# EasyEDA Pro project 电子挂牌.eprj, board PCB1
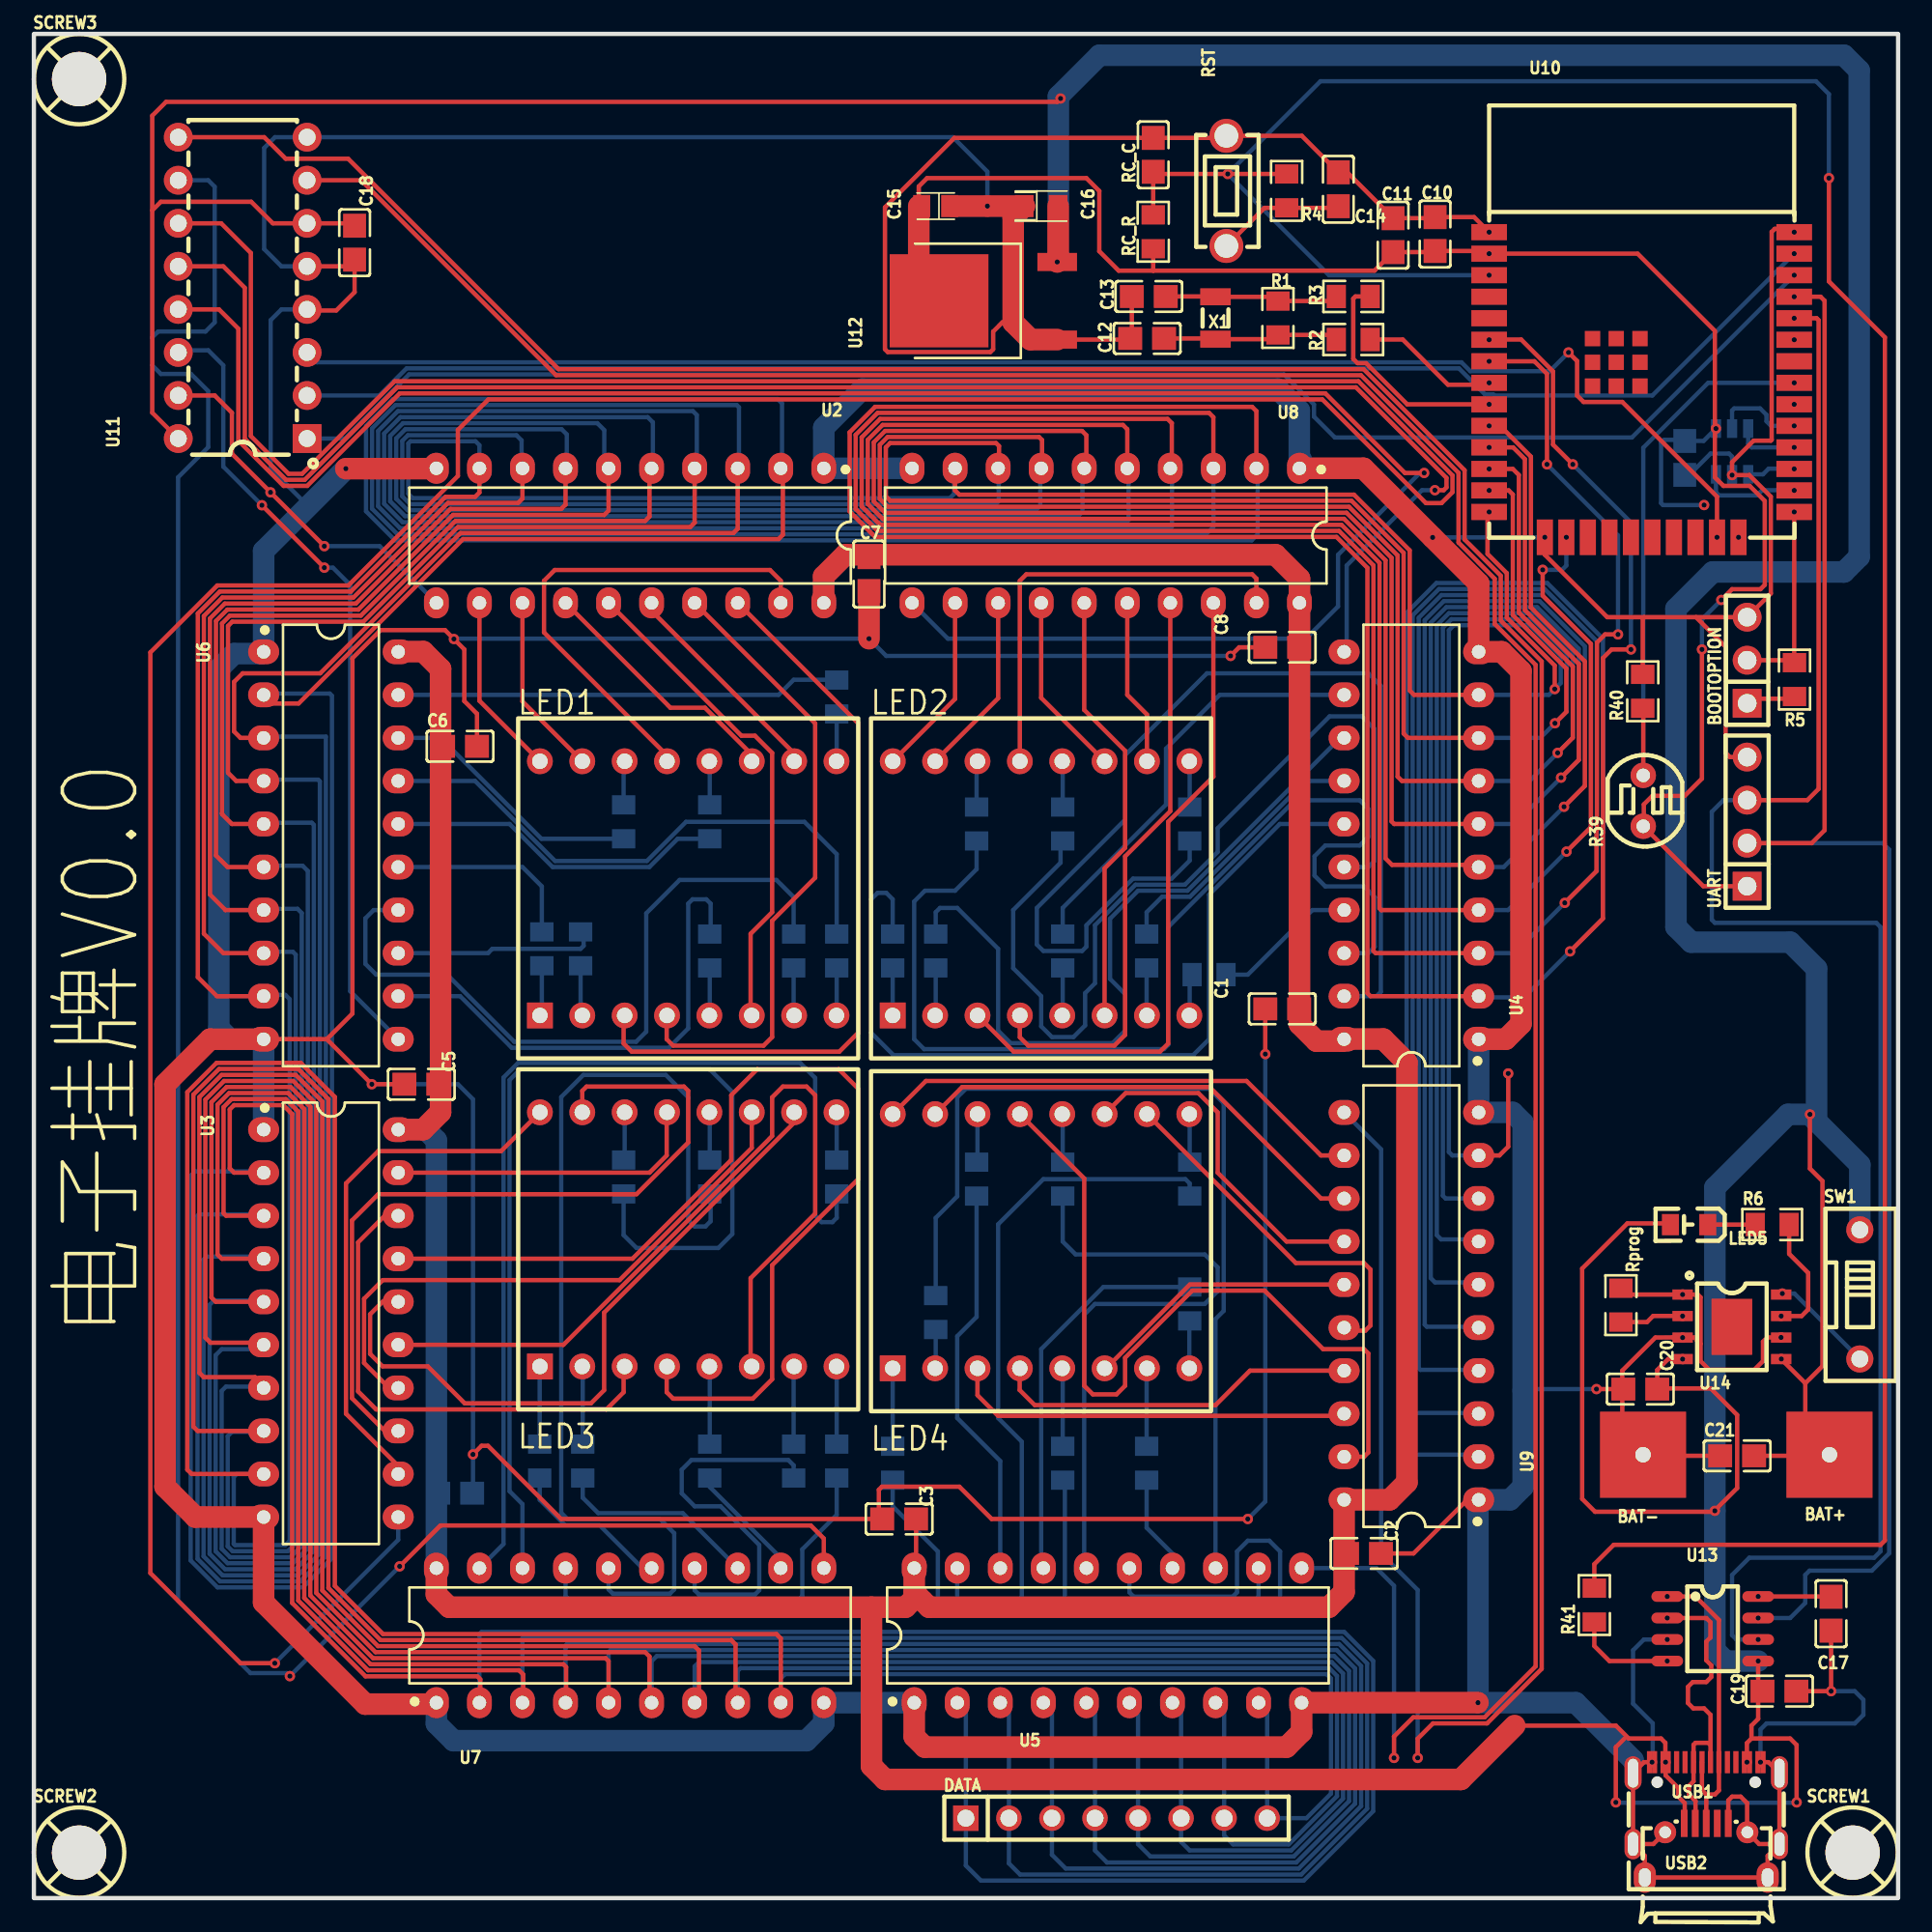
[diagram p1: board, top side]
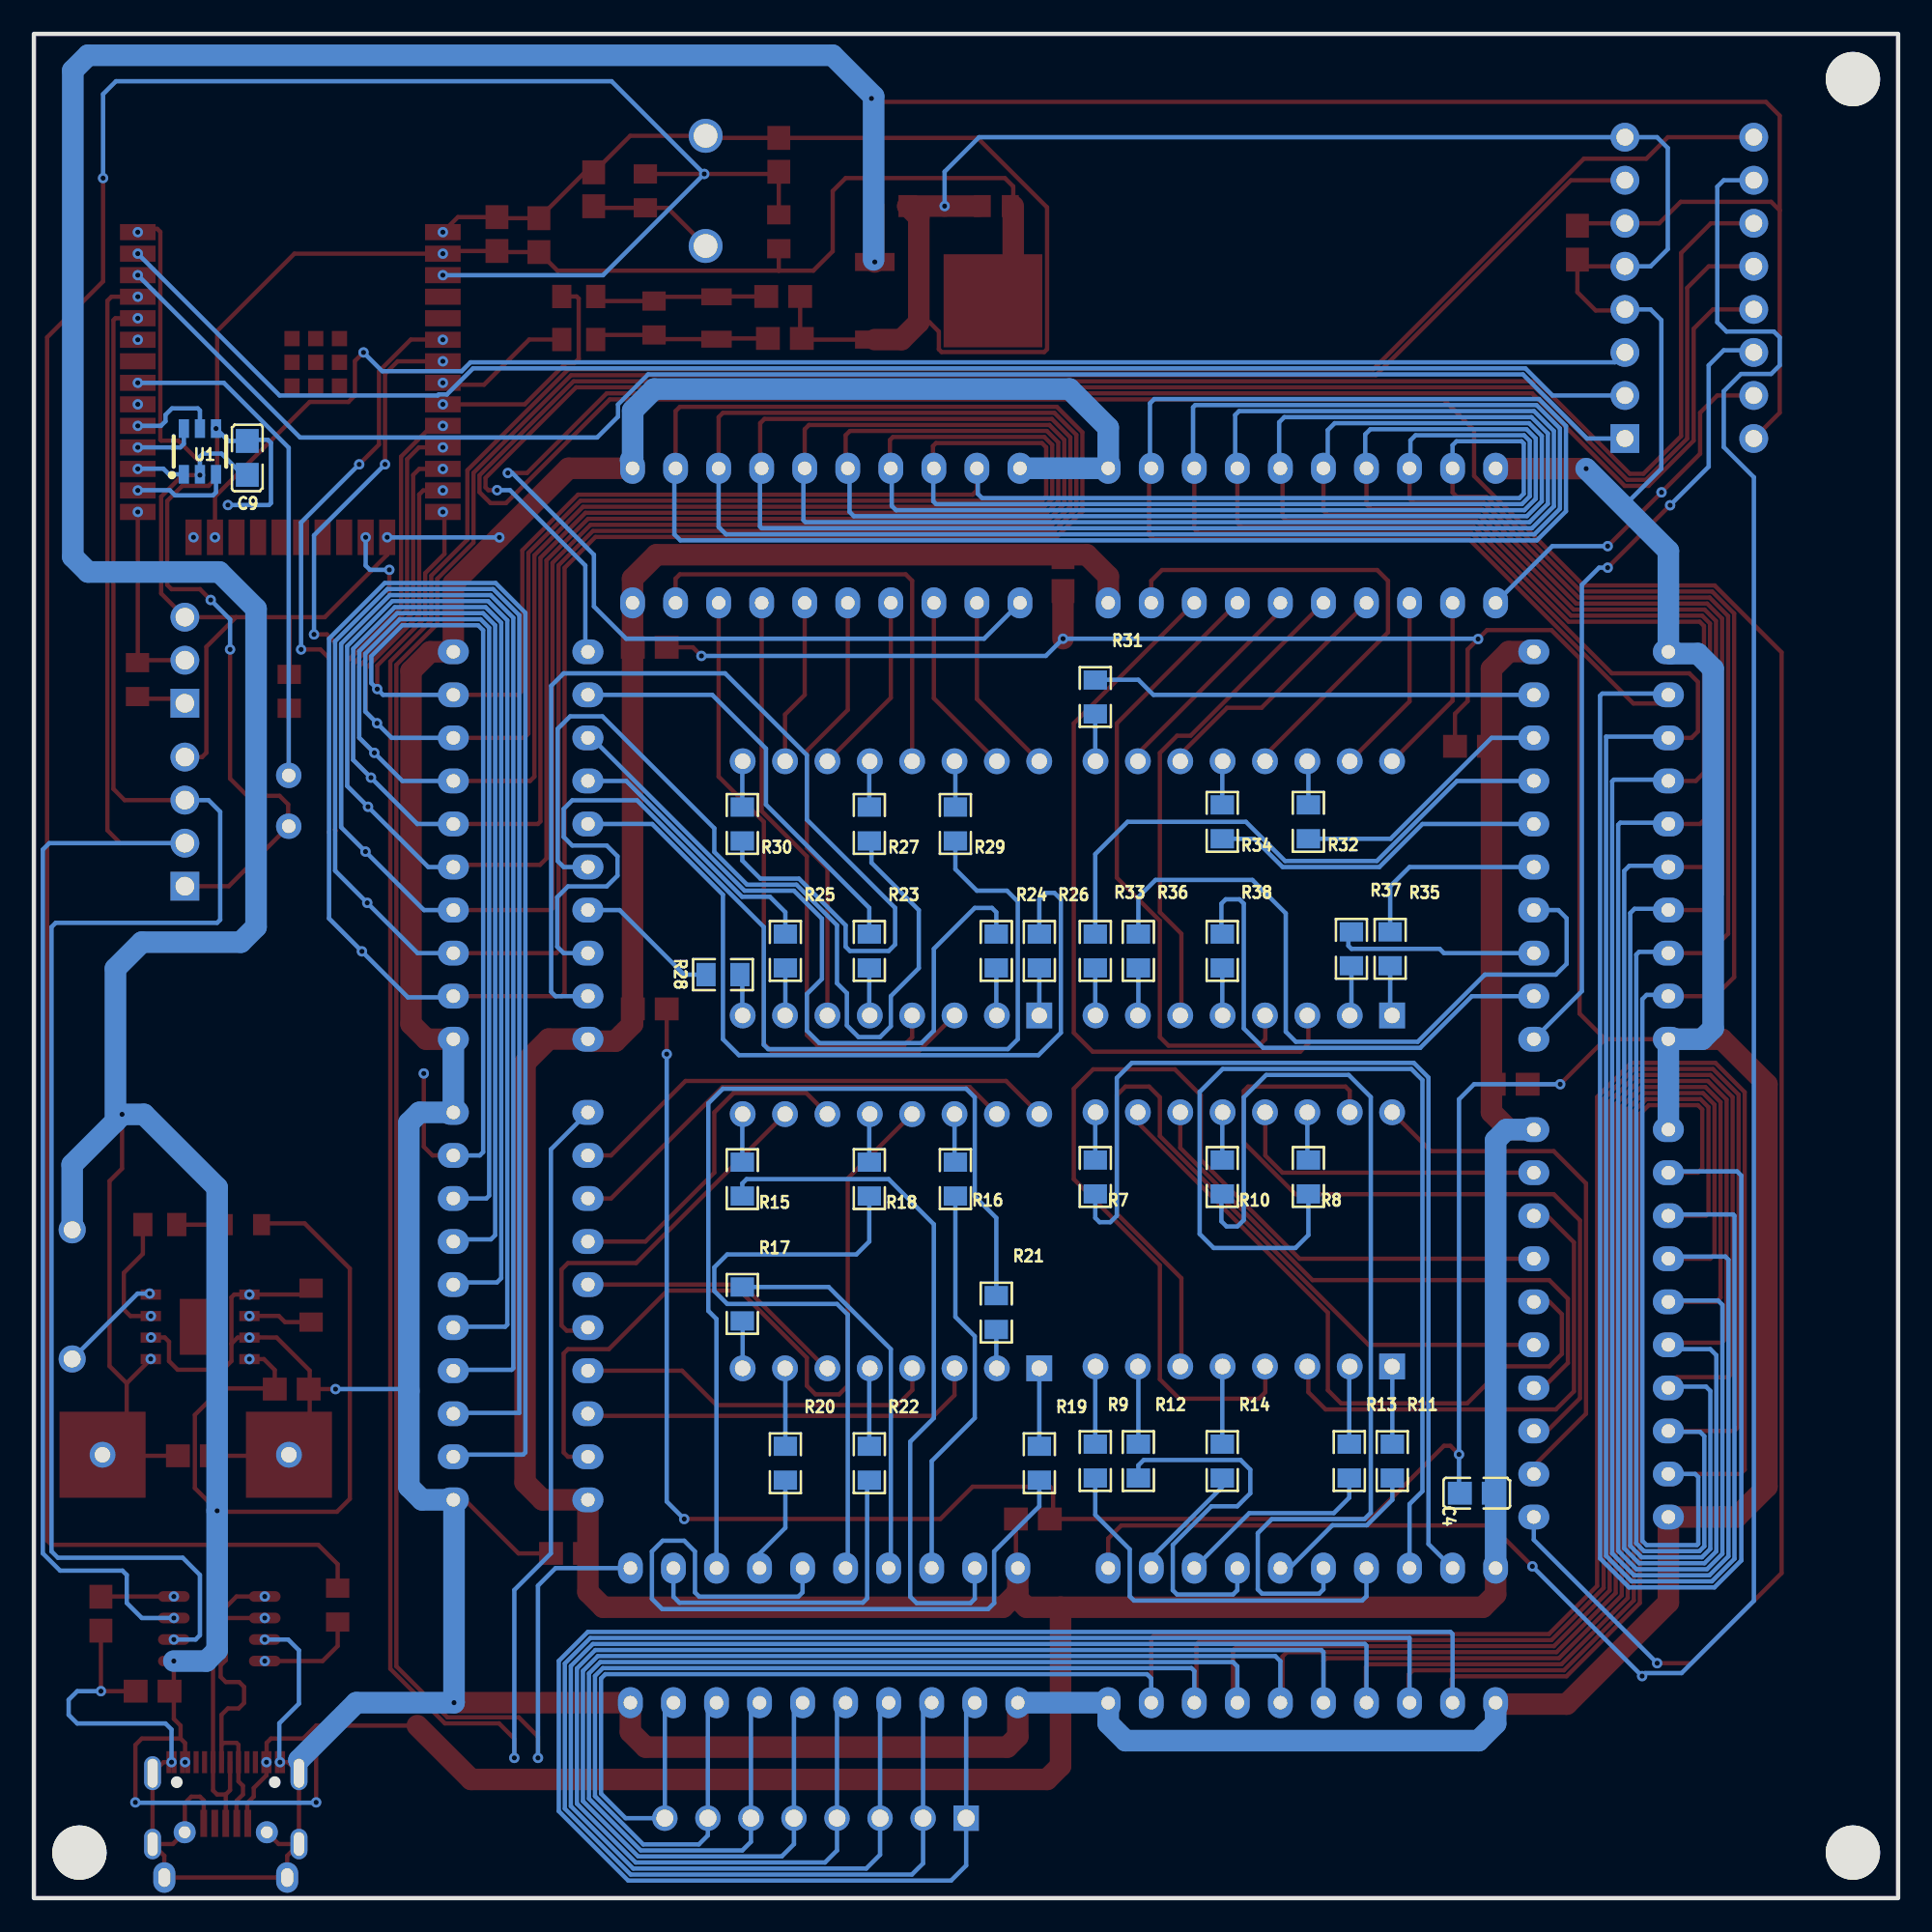
[diagram p2: board, bottom side, seen from below]

Outline 110 x 110 mm; copper layers: Top Layer, Bottom Layer. Coordinates in mm from the lower left corner of the outline.
Outline path: rectangle 0,110 110,0
Stack: Top Layer 0.035mm / Dielectric1 1.51mm FR4 er 4.5 / Bottom Layer 0.035mm

## Design rules (mm)
net UD+: DP1
net UD-: DP1
template: JLCPCB Capability(Two Layers Board)
spacing copperThickness1oz (default): track to track 0.102, other pairs 0.152 to 0.3
spacing copperThickness2oz: track to track 0.203, other pairs 0.152 to 0.3
track width copperThickness1oz (default): min 0.127, default 0.254, max 2.54
track width copperThickness2oz: min 0.203, default 0.254, max 2.54
differential pair differentialPair (default): width min 0.127, default 0.254, max 2.54; gap min 0.152, default 0.152
via viaSize (default): diameter min 0.5, default 0.61, max 10; hole min 0.3, default 0.305, max 6.3

## Placement (name value [footprint] x y rotation side)
BAT+  -  [Test-Point-0.5mm]  105.95 26.16 270 top
BAT-  -  [Test-Point-0.5mm]  94.95 26.16 270 top
BOOTOPTION  PZ254V-11-03P  [HDR-TH_3P-P2.54-V-M]  101.09 73.04 90 top
C1  0.1uf  [C0805]  73.66 52.47 180 top
C2  0.1uf  [C0805]  78.49 20.34 0 top
C3  0.1uf  [C0805]  51.05 22.37 180 top
C4  0.1uf  [C0805]  24.86 23.89 0 bottom
C5  0.1uf  [C0805]  22.86 48.02 180 top
C6  0.1uf  [C0805]  25.15 67.96 0 top
C7  0.1uf  [C0805]  49.28 78.12 270 top
C8  0.1uf  [C0805]  73.66 73.8 180 top
C9  0.1uf  [C0805]  97.41 84.98 270 bottom
C10  0.1uf  [C0805]  82.68 98.19 270 top
C11  22uf  [C0805]  80.2 98.13 270 top
C12  12pf  [C0805]  65.69 92.03 0 top
C13  12pf  [C0805]  65.79 94.51 0 top
C14  0.1uf  [C0805]  76.97 100.83 270 top
C15  10uF  [CAP-SMD_L2.1-W1.4-FD]  53.21 99.84 180 top
C16  22uF  [CAP-SMD_L2.0-W1.3-FD]  59.44 99.84 0 top
C17  0.1uf  [C0805]  106.05 16.78 270 top
C18  0.1uf  [C0805]  18.92 97.68 270 top
C19  0.1uf  [C0805]  103 12.21 0 top
C20  10uf  [C0805]  94.79 30.03 180 top
C21  10uf  [C0805]  100.5 26.1 0 top
DATA  PZ254V-11-08P  [HDR-TH_8P-P2.54-V-M]  63.88 4.72 0 top
LED1  SLD0888FR1C1BD-3.5D  [LED-MAT-TH_SLD0888FR1C1BD-3.5D]  38.61 59.58 0 top
LED2  SLD0888FR1C1BD-3.5D  [LED-MAT-TH_SLD0888FR1C1BD-3.5D]  59.43 59.58 0 top
LED3  SLD0888FR1C1BD-3.5D  [LED-MAT-TH_SLD0888FR1C1BD-3.5D]  38.61 38.87 0 top
LED4  SLD0888FR1C1BD-3.5D  [LED-MAT-TH_SLD0888FR1C1BD-3.5D]  59.43 38.76 0 top
LED5  -  [LED_0805]  97.62 39.74 180 top
NOREF  -  [Pad_e7802]  105.95 26.16 0 top
NOREF#2  -  [Pad_e7801]  94.95 26.16 0 top
R1  5M~10M  [R0805]  73.41 93.24 270 top
R2  0  [R0805]  77.85 91.97 0 top
R3  0  [R0805]  77.85 94.51 0 top
R4  0  [R0805]  73.92 100.74 90 top
R5  0  [R0805]  103.89 71.9 270 top
R6  10K  [R0805]  102.57 39.74 0 top
R7  10K  [R0805]  47.37 42.55 90 bottom
R8  10K  [R0805]  34.8 42.55 90 bottom
R9  10K  [R0805]  47.37 25.79 90 bottom
R10  10K  [R0805]  39.88 42.55 90 bottom
R11  10K  [R0805]  29.84 25.79 90 bottom
R12  10K  [R0805]  44.83 25.79 90 bottom
R13  10K  [R0805]  32.39 25.79 90 bottom
R14  10K  [R0805]  39.88 25.79 90 bottom
R15  10K  [R0805]  68.2 42.42 90 bottom
R16  10K  [R0805]  55.63 42.42 90 bottom
R17  10K  [R0805]  68.2 35.06 270 bottom
R18  10K  [R0805]  60.71 42.42 90 bottom
R19  10K  [R0805]  50.67 25.66 90 bottom
R20  10K  [R0805]  65.66 25.66 90 bottom
R21  10K  [R0805]  53.21 34.55 270 bottom
R22  10K  [R0805]  60.71 25.66 90 bottom
R23  10K  [R0805]  60.71 55.89 270 bottom
R24  10K  [R0805]  53.21 55.89 270 bottom
R25  10K  [R0805]  65.66 55.89 270 bottom
R26  10K  [R0805]  50.67 55.89 270 bottom
R27  10K  [R0805]  60.71 63.38 90 bottom
R28  10K  [R0805]  69.34 54.49 180 bottom
R29  10K  [R0805]  55.63 63.38 90 bottom
R30  10K  [R0805]  68.2 63.38 90 bottom
R31  10K  [R0805]  47.37 70.87 270 bottom
R32  10K  [R0805]  34.8 63.51 90 bottom
R33  10K  [R0805]  47.37 55.89 270 bottom
R34  10K  [R0805]  39.88 63.51 90 bottom
R35  10K  [R0805]  29.97 56.01 270 bottom
R36  10K  [R0805]  44.83 55.89 270 bottom
R37  10K  [R0805]  32.26 56.01 270 bottom
R38  10K  [R0805]  39.88 55.89 270 bottom
R39  GL5506（4-7K）  [RES-TH_L5.1-W4.3-P3.00-D0.5]  94.96 64.75 90 top
R40  10K  [R0805]  94.93 71.21 90 top
R41  0  [R0805]  92.08 17.29 90 top
RC_C  1uf  [C0805]  66.05 102.86 270 top
RC_R  10K  [R0805]  66.05 98.32 270 top
Rprog  10K  [R0805]  93.64 34.99 270 top
RST  ZX-QC36-4.3CJ  [KEY-TH_L6.0-W3.5-P6.50]  70.36 100.74 270 top
SCREW1  -  [M3螺丝]  107.31 2.69 0 top
SCREW2  -  [M3螺丝]  2.67 2.69 0 top
SCREW3  -  [M3螺丝]  2.67 107.33 0 top
SW1  Chager  [SW-TH_DSWB01LHGET]  107.74 35.62 0 top
U1  GT20L16S1Y  [SOT-23-6_L2.9-W1.6-P0.95-LS2.8-BR]  100.2 85.36 270 bottom
U2  SN74HC573N(XBLW)  [PDIP-20_L25.9-W6.6-P2.54-LS7.9-BL]  35.18 80.4 180 top
U3  SN74HC573N(XBLW)  [PDIP-20_L25.9-W6.6-P2.54-LS7.9-BL]  17.53 33.92 270 top
U4  SN74HC573N(XBLW)  [PDIP-20_L25.9-W6.6-P2.54-LS7.9-BL]  81.28 62.11 90 top
U5  SN74HC573N(XBLW)  [PDIP-20_L25.9-W6.6-P2.54-LS7.9-BL]  63.37 15.5 0 top
U6  SN74HC573N(XBLW)  [PDIP-20_L25.9-W6.6-P2.54-LS7.9-BL]  17.53 62.11 270 top
U7  SN74HC573N(XBLW)  [PDIP-20_L25.9-W6.6-P2.54-LS7.9-BL]  35.18 15.5 0 top
U8  SN74HC573N(XBLW)  [PDIP-20_L25.9-W6.6-P2.54-LS7.9-BL]  63.25 80.4 180 top
U9  SN74HC573N(XBLW)  [PDIP-20_L25.9-W6.6-P2.54-LS7.9-BL]  81.28 34.93 90 top
U10  ESP32-WROOM-32E-N8  [WIFI-SMD_ESP32-WROOM-32E]  94.87 89.3 270 top
U11  74HC238N  [PDIP-16_L19.3-W6.5-P2.54-LS7.6-BL]  12.32 95.01 90 top
U12  AMS1117CD-3.3  [TO-252-2_L6.5-W6.1-P4.58-LS10.0-BR]  56.9 94.25 0 top
U13  CH340N  [SOP-8_L4.9-W3.9-P1.27-LS6.0-BL]  99.06 15.89 270 top
U14  TP4056-42-ESOP8  [ESOP-8_L4.9-W3.9-P1.27-LS6.0-BL-EP]  100.19 33.71 270 top
UART  PZ254V-11-04P  [HDR-TH_4P-P2.54-V-M]  101.09 63.52 90 top
USB1  KH-TYPE-C-16P  [USB-C-SMD_KH-TYPE-C-16P]  98.68 5.61 0 top
USB2  MicroXNJ  [MICRO-USB-SMD_MICROXNJ]  98.68 2.81 0 top
X1  32.768kHz  [FC-135R_L3.2-W1.5]  69.72 93.24 270 top

## Footprints (pads in the part's own frame, mm; a bottom-side part is the same pattern mirrored in y, then rotated)
C0805
  rect 1.41x1.35 smd: 1(-1,0) 2(1,0)
CAP-SMD_L2.0-W1.3-FD
  rect 1.1x1.3 smd: 1(-1,0) 2(1,0)
CAP-SMD_L2.1-W1.4-FD
  rect 1x1.3 smd: 1(-0.825,0) 2(0.825,0)
ESOP-8_L4.9-W3.9-P1.27-LS6.0-BL-EP
  rect 0.6x1.2 smd: 1(-1.905,-2.909) 2(-0.635,-2.909) 3(0.635,-2.909) 4(1.905,-2.909) 5(1.905,2.909) 6(0.635,2.909) 7(-0.635,2.909) 8(-1.905,2.909)
  rect 3.3x2.4 smd: 9(0,0)
FC-135R_L3.2-W1.5
  rect 1x1.8 smd: 1(-1.25,0) 2(1.25,0)
HDR-TH_3P-P2.54-V-M
  rect 1.7x1.7 hole 1.1: 1(-2.54,0)
  round 1.7 hole 1.1: 2(0,0) 3(2.54,0)
HDR-TH_4P-P2.54-V-M
  rect 1.7x1.7 hole 1.1: 1(-3.81,0)
  round 1.7 hole 1.1: 2(-1.27,0) 3(1.27,0) 4(3.81,0)
HDR-TH_8P-P2.54-V-M
  rect 1.5x1.5 hole 1: 1(-8.89,0)
  round 1.5 hole 1: 2(-6.35,0) 3(-3.81,0) 4(-1.27,0) 5(1.27,0) 6(3.81,0) 7(6.35,0) 8(8.89,0)
KEY-TH_L6.0-W3.5-P6.50
  round 2 hole 1.4: 1(-3.25,0) 2(3.25,0)
LED-MAT-TH_SLD0888FR1C1BD-3.5D
  rect 1.524x1.524 hole 0.914: 1(-8.75,-7.5)
  round 1.524 hole 0.914: 2(-6.25,-7.5) 3(-3.75,-7.5) 4(-1.25,-7.5) 5(1.25,-7.5) 6(3.75,-7.5) 7(6.25,-7.5) 8(8.75,-7.5) 9(8.75,7.5) 10(6.25,7.5) 11(3.75,7.5) 12(1.25,7.5) 13(-1.25,7.5) 14(-3.75,7.5) 15(-6.25,7.5) 16(-8.75,7.5)
LED_0805
  rect 1x1.25 smd: 1(-1.15,0.005) 2(1.05,0.005)
M3螺丝
  round 3.2 hole 3.2: 1(0,0)
MICRO-USB-SMD_MICROXNJ
  rect 0.4x1.6 smd: 1(-1.3,1.597) 2(-0.65,1.597) 3(0,1.597) 4(0.65,1.597) 5(1.3,1.597)
  round 1.3 hole 0.7: 6(2.425,1.074) 9(-2.425,1.073)
  oval 1.3x1.8 hole 0.7x1.1: 7(3.625,-1.597) 8(-3.625,-1.597)
Pad_e7801
  round 1.524 hole 0.914: 1(0,0)
Pad_e7802
  round 1.524 hole 0.914: 2(0,0)
PDIP-16_L19.3-W6.5-P2.54-LS7.6-BL
  rect 1.7x1.7 hole 1: 1(-8.89,-3.8)
  round 1.7 hole 1: 2(-6.35,-3.8) 3(-3.81,-3.8) 4(-1.27,-3.8) 5(1.27,-3.8) 6(3.81,-3.8) 7(6.35,-3.8) 8(8.89,-3.8) 9(8.89,3.8) 10(6.35,3.8) 11(3.81,3.8) 12(1.27,3.8) 13(-1.27,3.8) 14(-3.81,3.8) 15(-6.35,3.8) 16(-8.89,3.8)
PDIP-20_L25.9-W6.6-P2.54-LS7.9-BL
  oval 1.462x1.827 hole 0.8: 1(-11.43,-3.97) 2(-8.89,-3.97) 3(-6.35,-3.97) 4(-3.81,-3.97) 5(-1.27,-3.97) 6(1.27,-3.97) 7(3.81,-3.97) 8(6.35,-3.97) 9(8.89,-3.97) 10(11.43,-3.97) 11(11.43,3.97) 12(8.89,3.97) 13(6.35,3.97) 14(3.81,3.97) 15(1.27,3.97) 16(-1.27,3.97) 17(-3.81,3.97) 18(-6.35,3.97) 19(-8.89,3.97) 20(-11.43,3.97)
R0805
  rect 1.133x1.377 smd: 1(-1,0) 2(1,0)
RES-TH_L5.1-W4.3-P3.00-D0.5
  round 1.5 hole 0.8: 1(-1.5,0) 2(1.5,0)
SOP-8_L4.9-W3.9-P1.27-LS6.0-BL
  oval 0.63x1.865 smd: 1(-1.905,-2.683) 2(-0.635,-2.683) 3(0.635,-2.683) 4(1.905,-2.683) 5(1.905,2.683) 6(0.635,2.683) 7(-0.635,2.683) 8(-1.905,2.683)
SOT-23-6_L2.9-W1.6-P0.95-LS2.8-BR
  rect 1.1x0.6 smd: 1(1.35,-0.95) 2(1.35,0) 3(1.35,0.95) 4(-1.35,0.95) 5(-1.35,0) 6(-1.35,-0.95)
SW-TH_DSWB01LHGET
  round 1.6 hole 1: 1(0,3.81) 2(0,-3.81)
Test-Point-0.5mm
  rect 5.08x5.08 smd: 1(0,0)
TO-252-2_L6.5-W6.1-P4.58-LS10.0-BR
  rect 2.336x1.064 smd: 1(3.486,-2.29) 3(3.486,2.29)
  rect 5.826x5.491 smd: 4(-3.486,0)
USB-C-SMD_KH-TYPE-C-16P
  oval 1x2 hole 0.6x1.7: 1(-4.32,1.765) 2(4.32,1.765)
  oval 1x1.8 hole 0.6x1.4: 3(-4.32,-2.415) 4(4.32,-2.415)
  rect 0.3x1.3 smd: A1(-3.35,2.415) A4(-2.55,2.415) A5(-1.25,2.415) A6(-0.25,2.415) A7(0.25,2.415) A8(1.25,2.415) A9(2.55,2.415) A12(3.35,2.415) B1(3.05,2.415) B4(2.25,2.415) B5(1.75,2.415) B6(0.75,2.415) B7(-0.75,2.415) B8(-1.75,2.415) B9(-2.25,2.415) B12(-3.05,2.415)
WIFI-SMD_ESP32-WROOM-32E
  rect 0.95x2.1 smd: 1(-9.002,-9) 2(-7.732,-9) 3(-6.463,-9) 4(-5.192,-9) 5(-3.922,-9) 6(-2.652,-9) 7(-1.383,-9) 8(-0.113,-9) 9(1.157,-9) 10(2.428,-9) 11(3.697,-9) 12(4.968,-9) 13(6.237,-9) 14(7.508,-9) 25(7.508,9) 26(6.237,9) 27(4.968,9) 28(3.697,9) 29(2.428,9) 30(1.157,9) 31(-0.113,9) 32(-1.383,9) 33(-2.652,9) 34(-3.922,9) 35(-5.192,9) 36(-6.463,9) 37(-7.732,9) 38(-9.002,9)
  rect 2.1x0.95 smd: 15(9.002,-5.715) 16(9.002,-4.445) 17(9.002,-3.175) 18(9.002,-1.905) 19(9.002,-0.635) 20(9.002,0.635) 21(9.002,1.905) 22(9.002,3.175) 23(9.002,4.445) 24(9.002,5.715)
  rect 0.9x0.9 smd: 39(-2.721,-0.1) 39(-2.721,-1.5) 39(-2.721,-2.9) 39(-1.321,-0.1) 39(-1.321,-1.5) 39(-1.321,-2.9) 39(0.079,-0.1) 39(0.079,-1.5) 39(0.079,-2.9)

## Nets
As in the schematic, except:
GND: BAT-.1 BOOTOPTION.3 C1.2 C2.2 C3.2 C4.2 C5.2 C6.2 C7.2 C8.2 C9.2 C10.1 C11.1 C12.1 C13.1 C14.1 C15.1 C16.1 C17.2 C18.2 C19.2 C20.2 C21.1 NOREF#2.1 R40.2 RC_C.1 Rprog.1 RST.1 U1.2 U2.1 U2.10 U3.1 U3.10 U4.1 U4.10 U5.1 U5.10 U6.1 U6.10 U7.1 U7.10 U8.1 U8.10 U9.1 U9.10 U10.1 U10.15 U10.38 U11.4 U11.5 U11.8 U12.1 U13.3 U14.1 U14.3 U14.6 UART.4 USB1.1 USB1.2 USB1.3 USB1.4 USB1.A1 USB1.A12 USB1.B1 USB1.B12 USB2.5 USB2.6 USB2.7 USB2.8 USB2.9
VCC: BAT+.1 C1.1 C2.1 C3.1 C4.1 C5.1 C6.1 C7.1 C8.1 C16.2 C18.1 C19.1 C20.1 C21.2 LED5.2 NOREF.2 SW1.1 U2.20 U3.20 U4.20 U5.20 U6.20 U7.20 U8.20 U9.20 U11.6 U11.16 U12.3 U13.5 U14.4 U14.5 USB1.A4 USB1.A9 USB1.B4 USB1.B9 USB2.1
ESP32_EN: R4.2 R41.1 R41.2 RC_C.2 RC_R.1 U10.3 U13.4

Pads without a net: SCREW1 1; SCREW2 1; SCREW3 1; U10 4 5 17 18 19 20 21 22 32 39; U14 9; USB1 A5 A8 B5 B8; USB2 4

## Via types
v1: diameter 0.61, hole 0.305, Top Layer to Bottom Layer, 101 vias

## Routing (per net, layer and track width the routed paths; a pad name or vN(x,y) marks a point on that pad's centre or on a via; arc(x,y) is an arc through that point)
GND: length 844.8
  Top Layer w0.254: C19.2 v1(106.05,12.21) C17.2 ; 16.13,93.74 16.19,93.68 17.84,93.68 18.92,94.76 18.92,96.03 18.67,96.28 18.53,96.28 ; USB1.4 USB1.2 102.35,8.02 v1(101.88,8.02) ; USB1.4 102.3,2.5 USB2.7 USB2.8 95.05,2.5 USB1.3 ; USB1.4 101.8,3.19 101.09,3.9 101.09,5.61 100.71,5.99 100.2,5.99 99.98,5.76 USB2.5 ; v1(70.61,73.3) 71.12,73.8 C8.2 ; 16.13,96.28 18.53,96.28 ; 18.53,96.28 C18.2 ; 98.34,32.71 98.34,35.45 98.18,35.61 v1(97.28,35.61) 94.02,35.61 Rprog.1 ; 98.34,32.71 98.34,31.69 98.85,31.18 101.52,31.18 102.03,31.69 102.03,32.83 102.28,33.08 v1(103.09,33.08) U14.6 ; 98.34,32.71 97.98,33.07 v1(97.28,33.07) ; 95.02,75.58 94.93,75.5 R40.2 ; 95.02,75.58 92.84,75.58 89.15,79.27 v1(89.15,80.3) ; 95.02,75.58 98.07,75.58 ; v1(25.91,26.18) 26.42,26.69 26.8,26.69 31.12,22.37 C3.2 49.86,22.57 49.86,24.1 50.04,24.28 54.61,24.28 56.52,22.37 v1(71.63,22.37) ; USB1.3 USB1.1 95.01,8.02 v1(95.48,8.02) ; USB1.3 95.56,3.19 USB2.9 ; 93.73,30.03 93.73,27.39 BAT-.1 ; 93.73,30.03 93.73,31.12 95.68,33.08 96.69,33.09 96.69,33.08 ; 93.73,30.03 C20.2 ; 93.73,30.03 v1(92.2,30.03) ; UART.4 100.08,67.33 99.82,67.58 99.82,73.83 98.07,75.58 ; C13.1 64.79,92.13 C12.1 64.62,91.96 U12.1 ; 98.07,75.58 BOOTOPTION.3 102.49,76.98 102.49,82.69 101.22,83.96 v1(100.2,83.96) 100.2,84.73 101.47,86 102.49,86 102.54,86.05 102.54,98.32 102.72,98.5 103.68,98.5 v1(103.87,98.3) ; C5.2 v1(19.94,48.02) 17.28,50.68 ; C1.2 v1(72.66,49.8) ; C2.2 81.41,20.34 84.46,23.39 85.13,23.39 U9.1 ; v1(85.87,98.3) 84.98,99.19 C10.1 82.61,99.13 C11.1 77.5,101.83 C14.1 74.81,103.99 RST.1 70.24,103.86 RC_C.1 54.31,103.86 50.22,99.77 50.22,91.39 50.38,91.23 56.44,91.23 56.6,91.39 56.6,92.43 57.15,92.98 57.78,92.98 ; C21.1 95.01,26.1 ; 17.28,50.68 U6.10 ; 17.28,50.68 18.8,52.19 18.8,73.16 20.45,74.82 24.26,74.82 v1(24.78,74.29) 25.4,73.68 25.4,70.63 26.15,69.88 C6.2
  Top Layer w1.27: U6.10 10.4,50.68 7.74,48.02 7.74,24.28 9.53,22.49 U3.10 13.56,17.44 19.55,11.45 23.67,11.45 U7.1 ; U8.1 78.46,84.37 v1(82.53,80.29) 85.25,77.57 U4.10 86.62,73.54 87.75,72.41 87.75,51.58 86.85,50.68 U4.1 ; 51.94,11.53 51.94,9.53 52.57,8.91 73.91,8.91 74.8,9.81 U5.10 v1(85.21,11.53) ; U12.1 58.81,91.96 57.78,92.98 57.78,99.19 C16.1 v1(56.26,99.84) 54.21,99.84 ; U2.10 23.73,84.35 v1(18.41,84.35) ; C7.2 v1(49.28,74.31)
  Bottom Layer w0.254: v1(106.05,12.21) 107.44,12.21 107.95,11.7 107.95,10.81 107.44,10.31 102.24,10.31 101.88,9.95 v1(101.88,8.02) ; v1(56.26,99.84) 56.26,101.87 54.23,103.9 U11.8 14.22,103.9 13.59,103.27 13.59,97.3 14.61,96.28 16.13,96.28 ; v1(92.2,30.03) 87.97,30.03 87.88,29.94 ; v1(71.63,22.37) 72.66,23.4 v1(72.66,49.8) ; C4.2 25.91,23.94 v1(25.91,26.18) 25.91,47.13 25.02,48.02 v1(19.94,48.02) ; 16,82.31 13.97,84.35 13.97,93.11 14.61,93.74 16.13,93.74 ; v1(96.38,15.26) 95,15.26 94.36,14.62 94.36,11.47 95.52,10.31 95.52,8.06 v1(95.48,8.02) ; v1(82.53,80.29) 89.15,80.29 v1(89.15,80.3) ; U1.2 100.2,85.06 100.02,85.23 98.93,85.23 97.68,83.98 C9.2 ; v1(70.61,73.3) 50.29,73.3 v1(49.28,74.31) 24.77,74.31
  Bottom Layer w1.27: 74.8,84.85 74.67,84.98 74.67,87.77 73.4,89.04 48.89,89.04 46.61,86.77 U2.1 U8.10 ; 94.36,8.13 94.36,8.15 90.98,11.53 v1(85.21,11.53) 85.21,23.46 U9.1 87.1,23.5 87.88,24.28 87.88,45.74 87.25,46.36 U9.10 U4.1 ; 51.94,11.53 U7.10 46.61,10.31 45.59,9.29 24.76,9.29 23.75,10.3 U7.1 ; v1(18.41,84.35) 13.56,79.49 U6.1 13.45,73.43 11.81,73.43 10.91,72.53 10.91,51.33 11.56,50.68 U6.10 U3.1
VCC: length 651.5
  Top Layer w0.254: USB2.1 97.41,4.44 97.41,5.61 97.03,5.99 97.03,6.5 96.28,7.24 v1(96.28,8.02) 96.27,8.03 96.27,9.16 96.01,9.42 94.11,9.42 93.34,10.18 87.38,10.18 ; v1(104.01,5.65) 104.01,9.03 103.63,9.42 101.35,9.42 ; C18.1 18.78,98.82 U11.6 14.1,98.82 12.83,100.09 7.49,100.09 6.98,99.59 ; v1(93.34,5.65) 93.34,8.91 93.85,9.42 ; 101.35,9.42 101.08,9.15 v1(101.08,8.02) ; 101.35,9.42 101.35,10.18 101.74,10.57 v1(101.74,13.99) ; 6.98,99.59 6.98,105.17 7.8,105.99 60.38,105.99 v1(60.58,106.19) ; 6.98,99.59 6.98,87.65 8.51,86.12 ; v1(97.28,31.8) 96.43,31.8 95.79,31.16 95.79,30.07 98.94,30.07 100.5,28.51 100.5,24.19 99.1,22.8 92.12,22.8 91.36,23.56 91.36,37.15 94.03,39.81 96.49,39.81 LED5.2 ; v1(104.8,46.25) 104.8,43.05 105.54,42.31 105.54,31.39 104.53,30.38 ; C21.2 104.53,26.1 ; 104.53,26.1 104.53,30.38 ; 104.53,26.1 105.89,26.1 NOREF.2 ; 52.05,19.59 C3.1 ; 104.53,30.38 U14.5 ; 51.94,19.47 52.05,19.58
  Top Layer w1.27: 52.06,17.92 52.82,17.16 76.41,17.16 77.31,18.06 U9.20 79.99,23.5 81.02,24.53 81.02,49.29 79.62,50.69 77.32,50.69 77.19,50.56 75.68,50.56 74.68,51.57 U8.20 74.68,77.86 73.27,79.27 47.87,79.27 46.6,78 46.6,76.44 U2.20 ; 52.06,17.92 51.94,18.04 51.94,19.47 ; 52.06,17.92 52.06,17.8 51.43,17.16 49.42,17.16 ; 52.05,19.58 52.05,19.59 ; C16.2 60.44,96.6 v1(60.38,96.54) ; 87.38,10.18 84.2,7 50.22,7 49.42,7.8 49.42,17.16 ; U3.20 22.97,45.35 24,46.37 24,72.53 22.98,73.55 21.51,73.55 U6.20 ; 49.42,17.16 24.5,17.16 23.75,17.92 U7.20
  Bottom Layer w0.254: v1(93.34,5.65) 93.36,5.63 103.99,5.63 v1(104.01,5.65)
  Bottom Layer w1.27: 105.19,45.83 104.78,46.25 103.5,46.25 99.19,41.93 v1(99.19,22.85) 99.19,14.62 99.82,13.99 v1(101.74,13.99) ; 105.19,45.83 107.74,43.28 SW1.1 ; 105.19,45.83 105.19,54.85 103.63,56.41 97.79,56.41 96.89,57.3 96.89,76.08 99.06,78.25 106.81,78.25 107.71,79.15 107.71,107.84 106.81,108.74 62.87,108.74 60.45,106.32 60.45,96.66 ; U7.20 23.75,44.71 23.12,45.35 U3.20
  vias: v1(103.11,31.81)
VDD33: length 116.2
  Top Layer w0.254: 66.05,96.03 79.1,96.03 C11.2 82.61,97.13 C10.2 85.71,97.19 v1(85.87,97.03) 94.63,97.03 99.19,92.47 99.19,86.78 v1(99.25,86.71) ; 66.05,96.03 64.01,96.03 62.87,97.17 62.87,100.73 62.1,101.49 52.71,101.49 52.21,101 52.21,99.84 ; 66.05,96.03 66.05,96.03 RC_R.2 ; UART.1 98.5,59.71 R39.1 95,63.28 95,64.53 95.5,65.04 97.41,65.04 98.43,66.06 v1(98.43,73.68) ; v1(99.57,76.6) 100.2,77.23 101.88,77.23 102.13,77.49 102.13,82.44 101.24,83.33 99.69,83.33 99.19,83.84 99.19,86.63
  Top Layer w1.27: U12.4 52.21,95.45 52.21,99.84
  Bottom Layer w0.254: v1(99.25,86.71) 98.52,85.98 C9.1 97.34,86.05 96.19,86.05 96.01,85.87 96.01,82.31 96.13,82.2 v1(98.55,82.2) ; v1(98.43,73.68) 98.43,75.46 v1(99.57,76.6)
573_CS_LED1_C: length 21.7
  Top Layer w0.254: v1(17.14,79.77) v1(13.96,82.95) 11.68,85.23 11.68,87.65 10.67,88.66 8.51,88.66
  Bottom Layer w0.254: v1(17.14,79.77) 20.4,79.77 U2.11
573_CS_LED1_R: length 47.4
  Top Layer w0.254: v1(17.14,78.5) v1(13.45,82.19)
  Bottom Layer w0.254: v1(17.14,78.5) 17.65,78.5 18.66,77.49 18.66,53.52 U6.11 ; 8.51,91.2 8.64,91.33 10.29,91.33 11.18,90.44 11.18,84.46 v1(13.45,82.19)
573_CS_LED2_C: length 122.8
  Top Layer w0.254: v1(82.03,84.09) 80.9,84.09 76.2,88.79 21.59,88.79 16.13,83.33 14.73,83.33 12.06,86 12.06,92.6 10.92,93.74 8.51,93.74
  Bottom Layer w0.254: U8.11 53.93,74.31 75.05,74.31 76.95,76.22 76.95,79.27 81.78,84.09 v1(82.03,84.09)
573_CS_LED2_R: length 103.3
  Top Layer w0.254: 8.51,96.28 11.18,96.28 12.45,95.01 12.45,86.12 14.88,83.69 15.98,83.69 21.44,89.15 78.01,89.15 83.35,83.8 83.35,83.24 83.19,83.08 v1(82.67,83.08)
  Bottom Layer w0.254: v1(82.67,83.08) 81.91,83.08 77.46,78.63 77.46,74.07 77.31,73.92 U4.11
573_CS_LED3_C: length 256.1
  Top Layer w0.254: v1(14.22,13.86) 12.19,13.86 6.88,19.18 6.88,73.5 10.82,77.45 18.56,77.45 25.02,83.92 25.02,86.63 26.82,88.43 76.02,88.43 82.14,82.31 83.06,82.31 83.71,82.96 83.71,83.95 78.16,89.5 21.29,89.5 15.83,84.04 15.03,84.04 12.8,86.27 12.8,97.07 11.05,98.82 8.51,98.82
  Bottom Layer w0.254: v1(14.22,13.86) 21.5,21.14 U3.11
573_CS_LED3_R: length 137.8
  Top Layer w0.254: U7.11 46.61,21.22 45.84,21.99 24,21.99 v1(21.58,19.58)
  Bottom Layer w0.254: v1(21.58,19.58) v1(15.11,13.1) 14.93,13.28 12.78,13.28 8.51,17.54 8.51,83.84 10.29,85.62 10.29,88.92 9.27,89.93 7.49,89.93 6.98,90.44 6.98,92.09 7.33,92.44 10.12,92.44 10.67,92.98 10.67,100.98 10.29,101.36 8.51,101.36
573_CS_LED4_C: length 206.7
  Top Layer w0.254: 8.51,103.9 13.59,103.9 14.86,102.63 18.54,102.63 30.96,90.21 78.46,90.21 84.42,84.25 84.42,80.17 86.55,78.03 86.55,75.38 88.97,72.97 88.97,13.53 85.75,10.31 82.56,10.31 81.65,9.41 v1(81.65,8.27)
  Bottom Layer w0.254: v1(81.65,8.27) 81.65,18.18 79.49,20.34 79.49,44.18 U9.11
573_CS_LED4_R: length 174.8
  Top Layer w0.254: 16.13,101.36 19.31,101.36 30.81,89.86 78.3,89.86 84.06,84.1 84.06,79.98 86.2,77.85 86.2,75.18 88.61,72.77 88.61,13.68 85.6,10.67 81.39,10.67 80.26,9.53 v1(80.26,8.27)
  Bottom Layer w0.254: U5.11 79.22,19.47 80.26,18.43 v1(80.26,8.27)
D0: length 610.5
  Top Layer w0.254: v1(90.81,84.6) 89.64,85.77 89.64,90.09 87.76,91.97 85.88,91.97 v1(85.87,91.95) ; v1(94.23,73.68) 93.09,73.68 92.59,73.17 92.59,62.89 92.58,62.89 92.58,57.8 v1(90.64,55.86) ; U8.2 72.14,87.74 71.88,87.99 49.64,87.99 48.13,86.49 48.13,81.82 49.64,80.32 76.86,80.32 78.69,78.49 78.69,53.4 78.87,53.22 U4.2 ; U6.2 14.06,70.49 15.62,70.49 25.32,80.19 43.94,80.19 44.2,80.45 44.2,84.24 U2.2 ; U7.2 26.34,11.58 26.34,12.91 26.16,13.09 19.57,13.09 15.24,17.42 15.24,46.26 14.71,46.79 11.81,46.79 11.56,46.54 11.56,43.06 11.81,42.81 U3.2
  Bottom Layer w0.254: 13.41,42.88 9.5,42.88 9.25,42.63 9.25,19.92 10.84,18.34 15.87,18.34 17.59,20.05 17.59,70.95 17.46,71.07 13.41,71.07 ; 72.34,84.29 72.21,84.17 72.21,80.47 71.86,80.12 21.31,80.12 19.6,81.83 19.6,86.87 21.19,88.45 43.89,88.45 44.14,88.2 44.14,84.29 ; v1(94.23,73.68) 94.23,81.17 v1(90.81,84.6) ; 85.18,25.6 84.61,26.17 81.13,26.17 81,26.3 81,75.84 82.76,77.6 89.3,77.6 92.58,74.31 92.58,57.8 v1(90.64,55.86) 87.93,53.15 85.82,53.15 85.18,53.79 ; U5.2 54.99,11.02 54.99,1.92 55.88,1.03 74.93,1.03 79.03,5.13 79.03,13.99 77.31,15.71 26.42,15.71 26.29,15.58 U7.2
D1: length 581.4
  Top Layer w0.254: U8.3 69.6,87.38 69.34,87.64 49.79,87.64 48.49,86.34 48.49,81.97 49.79,80.67 77.01,80.67 79.04,78.64 79.04,55.89 79.17,55.76 U4.3 ; v1(85.87,90.68) 88.54,90.68 89.28,89.94 v1(89.28,84.6) ; U3.3 11.34,40.27 11.19,40.42 11.19,46.67 11.66,47.15 14.86,47.15 15.6,46.41 15.6,17.56 19.72,13.44 28.62,13.44 28.88,13.19 28.88,11.58 U7.3 ; v1(93.47,74.57) 92.71,74.57 92.23,74.09 92.23,63.04 92.2,63.01 92.2,60.6 v1(90.33,58.73) ; U6.3 12.19,68.46 11.81,68.84 11.81,71.76 12.32,72.27 16.9,72.27 25.17,80.55 41.28,80.55 41.53,80.8 U2.3
  Bottom Layer w0.254: v1(93.47,74.57) 93.47,80.41 v1(89.28,84.6) ; 41.6,84.29 41.6,87.97 41.47,88.1 21.33,88.1 19.95,86.72 19.95,81.98 21.46,80.47 69.16,80.47 69.6,80.91 69.6,84.09 69.8,84.29 ; 13.41,40.34 9.73,40.34 9.66,40.26 9.66,20.02 10.98,18.69 15.72,18.69 17.23,20.2 17.23,68.53 13.41,68.53 ; 85.18,28.14 84.69,28.63 81.36,28.63 81.36,75.69 82.9,77.24 89.15,77.24 92.23,74.16 92.23,60.62 v1(90.33,58.73) 87.37,55.76 85.75,55.76 85.18,56.33 ; U7.3 28.83,15.35 77.17,15.35 78.67,13.85 78.67,5.28 74.78,1.39 58.19,1.39 57.53,2.05 DATA.2 57.53,11.02 U5.3
D2: length 539.2
  Top Layer w0.254: U2.4 38.99,81.16 38.74,80.9 25.03,80.9 19.44,75.32 11.71,75.32 11.45,75.06 11.45,66.4 11.94,65.92 U6.4 ; U4.4 79.5,58.3 79.4,58.4 79.4,78.79 77.16,81.03 49.93,81.03 48.84,82.12 48.84,86.19 49.93,87.28 66.89,87.28 67.14,87.03 67.14,84.46 U8.4 ; v1(90.43,61.75) 91.87,63.19 91.87,74.01 89.03,76.85 v1(89.03,78.38) ; U3.4 11.09,37.73 10.83,37.98 10.83,46.82 11.52,47.5 15.01,47.5 15.95,46.56 15.95,17.71 19.86,13.8 31.24,13.8 31.41,13.64 31.41,11.57 U7.4
  Bottom Layer w0.254: 85.18,58.87 85.75,58.3 86.98,58.3 v1(90.43,61.75) 91.87,63.19 91.87,74.01 89,76.89 83.05,76.89 81.71,75.55 81.71,31.27 81.81,31.17 84.68,31.17 85.18,30.68 ; v1(89.03,78.38) 90.17,78.38 90.42,78.63 v1(90.42,80.3) ; 39.06,84.29 39.12,84.35 39.12,87.51 38.89,87.74 21.48,87.74 20.31,86.57 20.31,82.13 21.61,80.83 67.06,80.83 67.16,80.93 67.16,84.19 67.26,84.29 ; 13.41,65.99 16.77,65.99 16.87,65.89 16.87,20.34 15.58,19.05 11.13,19.05 10.01,20.17 10.01,37.67 10.19,37.85 13.36,37.85 13.41,37.8 ; 59.56,11.53 60.07,11.02 DATA.3 60.07,2.56 60.88,1.75 74.63,1.75 78.32,5.43 78.32,13.7 77.02,15 31.47,15 31.37,14.89 U7.4
D3: length 515.2
  Top Layer w0.254: v1(90.29,64.4) 91.52,65.63 91.52,72.97 88.33,76.15 88.33,85.06 86.52,86.87 v1(85.87,86.87) ; U8.5 64.52,86.67 64.26,86.93 50.08,86.93 49.2,86.05 49.2,82.27 50.08,81.39 77.3,81.39 79.76,78.94 79.76,61.35 80.14,60.97 85.12,60.97 U4.5 ; U2.5 36.32,84.24 36.32,81.51 36.07,81.26 24.88,81.26 19.29,75.67 11.56,75.67 11.1,75.21 11.1,63.96 11.68,63.38 U6.5 ; U7.5 33.91,13.98 33.73,14.16 20.01,14.16 16.31,17.86 16.31,46.7 15.15,47.86 11.37,47.86 10.48,46.97 10.48,35.44 10.73,35.19 U3.5
  Bottom Layer w0.254: 62.1,11.53 62.61,11.02 DATA.4 62.61,2.81 63.32,2.1 74.49,2.1 77.96,5.57 77.96,13.55 76.87,14.64 34.03,14.64 33.91,14.51 U7.5 ; 13.41,35.26 10.62,35.26 10.37,35.01 10.37,20.32 11.28,19.4 15.43,19.4 16.52,20.49 16.52,63.33 16.39,63.45 13.41,63.45 ; 36.52,84.29 36.52,87.08 36.22,87.39 21.63,87.39 20.67,86.42 20.67,82.27 21.76,81.19 64.47,81.19 64.59,81.31 64.59,84.17 64.72,84.29 ; 85.18,33.22 84.68,33.71 82.19,33.71 82.07,33.84 82.07,75.4 83.2,76.53 88.85,76.53 91.52,73.87 91.52,65.62 v1(90.29,64.4) 86.73,60.84 85.75,60.84 85.18,61.41
D4: length 484.9
  Top Layer w0.254: U8.6 62.1,84.49 62.1,86.32 61.85,86.57 50.23,86.57 49.56,85.9 49.56,82.41 50.23,81.74 77.45,81.74 80.11,79.08 80.11,63.53 80.26,63.38 U4.6 ; U7.6 36.32,11.66 36.32,14.26 36.07,14.51 20.16,14.51 16.66,18 16.66,46.85 15.3,48.21 11.22,48.21 10.12,47.11 10.12,33.07 10.41,32.77 13.43,32.77 U3.6 ; U6.6 11.43,60.84 10.74,61.53 10.74,75.36 11.41,76.03 19.15,76.03 24.73,81.62 33.66,81.62 33.91,81.87 U2.6 ; v1(85.87,85.6) 87.28,85.6 87.98,84.91 87.98,76 91.16,72.82 91.16,67.16 v1(90.11,66.11)
  Bottom Layer w0.254: U5.6 65.15,11.02 DATA.5 65.15,3.18 65.88,2.46 74.34,2.46 77.6,5.72 77.6,13.4 76.72,14.28 36.75,14.28 36.45,13.98 U7.6 ; 85.18,63.95 85.75,63.38 87.38,63.38 v1(90.11,66.11) 91.16,67.16 91.16,73.72 88.7,76.17 83.35,76.17 82.42,75.25 82.42,36.58 82.68,36.33 84.61,36.33 85.18,35.76 ; 13.41,32.72 13.08,32.39 11.08,32.39 10.72,32.03 10.72,20.46 11.43,19.76 15.28,19.76 16.16,20.64 16.16,60.61 15.86,60.91 13.41,60.91 ; 62.18,84.29 61.87,83.99 61.87,81.8 61.62,81.54 21.9,81.54 21.02,82.42 21.02,86.28 21.78,87.03 33.25,87.03 33.66,86.62 33.66,84.62 33.98,84.29
D5: length 456.1
  Top Layer w0.254: U8.7 59.49,84.42 59.49,86.04 59.31,86.21 50.38,86.21 49.91,85.75 49.91,82.56 50.38,82.1 77.6,82.1 80.47,79.23 80.47,66.17 80.72,65.92 U4.7 ; v1(85.87,84.33) 87.26,84.33 87.62,83.97 87.62,75.85 90.81,72.67 90.81,68.47 v1(89.91,67.58) ; U3.7 13.56,30.23 13.05,30.74 10.02,30.74 9.76,30.99 9.76,47.26 11.07,48.57 15.45,48.57 17.02,47 17.02,18.15 20.31,14.87 38.99,14.87 39.24,14.61 39.24,11.78 U7.7 ; U6.7 11.3,58.3 10.39,59.22 10.39,75.51 11.27,76.39 19,76.39 24.58,81.97 31.12,81.97 31.37,82.23 U2.7
  Bottom Layer w0.254: 85.18,38.3 84.61,38.87 83.03,38.87 82.78,39.12 82.78,75.1 83.49,75.82 88.56,75.82 90.8,73.57 90.8,68.47 v1(89.91,67.58) 88.25,65.92 85.75,65.92 85.18,66.49 ; U7.7 38.99,13.67 39.24,13.93 76.58,13.93 77.25,13.26 77.25,5.87 74.19,2.81 68.2,2.81 67.69,3.32 DATA.6 67.69,11.02 U5.7 ; 13.41,58.37 15.55,58.37 15.81,58.12 15.81,20.79 15.14,20.12 11.57,20.12 11.08,20.61 11.08,29.93 11.33,30.18 13.41,30.18 ; 59.64,84.29 59.38,84.04 59.38,82.15 59.13,81.9 22.05,81.9 21.38,82.57 21.38,86.13 21.92,86.67 31.14,86.67 31.44,86.37 31.44,84.29
D6: length 425.9
  Top Layer w0.254: U6.8 11.18,55.76 10.03,56.91 10.03,75.65 11.12,76.74 18.85,76.74 24.44,82.33 28.58,82.33 28.83,82.58 U2.8 ; U3.8 9.66,27.57 9.41,27.82 9.41,47.41 10.93,48.93 15.6,48.93 17.38,47.15 17.38,18.3 20.45,15.22 41.15,15.22 41.4,14.97 41.4,11.66 U7.8 ; v1(89.75,69.32) 90.42,69.99 90.42,72.55 87.27,75.71 87.27,82.82 87.03,83.06 v1(85.87,83.06) ; U4.8 81.08,68.46 80.82,68.71 80.82,79.38 77.75,82.45 50.52,82.45 50.27,82.71 50.27,85.6 50.52,85.86 56.77,85.86 56.95,85.68 56.95,84.42 U8.8
  Bottom Layer w0.254: 13.41,55.83 15.28,55.83 15.45,55.67 15.45,20.93 14.99,20.47 11.72,20.47 11.44,20.76 11.44,27.26 11.69,27.51 13.28,27.51 13.41,27.64 ; 69.72,11.53 70.23,11.02 DATA.7 70.23,3.7 70.76,3.17 74.05,3.17 76.89,6.02 76.89,13.11 76.43,13.57 41.7,13.57 41.53,13.4 U7.8 ; 85.18,69.03 85.75,68.46 88.89,68.46 v1(89.75,69.32) 90.45,70.02 90.45,73.42 88.41,75.46 83.64,75.46 83.14,74.96 83.14,41.45 83.3,41.28 84.73,41.28 85.18,40.84 ; 57.1,84.29 56.93,84.13 56.93,82.42 56.76,82.25 22.2,82.25 21.73,82.72 21.73,85.98 22.07,86.32 28.47,86.32 28.78,86.01 28.78,84.42 28.9,84.29
D7: length 389.7
  Top Layer w0.254: U2.9 26.29,82.94 26.03,82.68 24.29,82.68 18.7,77.1 10.97,77.1 9.67,75.8 9.67,54.34 10.8,53.22 U6.9 ; U9.9 86.48,43.82 87,44.34 v1(87,48.66) ; v1(89.74,71.34) 89.74,72.73 86.91,75.56 86.91,78.18 85.77,79.31 85.77,81.7 v1(85.87,81.79) ; U3.9 9.31,25.03 9.05,25.28 9.05,47.56 10.78,49.28 15.74,49.28 17.76,47.27 17.76,18.42 20.6,15.58 43.81,15.58 44.07,15.33 U7.9 ; U8.9 54.36,83.06 54.61,82.81 77.89,82.81 81.18,79.52 81.18,71.25 81.43,71 U4.9
  Bottom Layer w0.254: 13.41,53.29 14.84,53.29 15.09,53.04 15.09,21.08 14.84,20.83 11.87,20.83 11.79,20.91 11.79,24.85 11.97,25.03 13.34,25.03 13.41,25.1 ; U7.9 44.07,12.96 44.32,13.22 76.28,13.22 76.54,12.96 76.54,6.16 75.09,4.72 DATA.8 72.77,11.02 72.26,11.53 ; U2.9 26.29,85.73 26.06,85.96 22.22,85.96 22.09,85.83 22.09,82.86 22.34,82.61 54.05,82.61 54.3,82.86 54.3,84.04 54.56,84.29 ; 85.18,71.57 85.75,71 89.4,71 v1(89.74,71.34) 90.09,71.69 90.09,73.28 88.26,75.11 83.79,75.11 83.49,74.81 83.49,44.02 83.69,43.82 84.73,43.82 85.18,43.38
ESP32_EN: length 178.4
  Top Layer w0.254: RC_R.1 RC_C.2 66.17,101.74 v1(70.44,101.74) R4.2 ; R41.2 92.08,19.7 93.22,20.85 108.97,20.85 109.22,21.1 109.22,92.09 105.92,95.39 v1(105.92,101.49) ; v1(96.38,13.99) 92.96,13.99 92.08,14.88 R41.1
  Bottom Layer w0.254: v1(85.87,95.76) 76.42,95.76 v1(70.44,101.74) 75.91,107.21 105.16,107.21 105.92,106.44 v1(105.92,101.49)
FONT_CS: length 5.9
  Bottom Layer w0.254: v1(103.87,83.06) 103.85,83.08 101.98,83.08 101.67,82.77 99.43,82.77 99.25,82.95 U1.3
FONT_SCLK: length 2.9
  Bottom Layer w0.254: U1.1 102.03,84.01 102.36,84.35 103.85,84.35 v1(103.87,84.33)
FONT_SI: length 3.7
  Bottom Layer w0.254: v1(103.87,85.6) 101.36,85.6 101.15,85.81 U1.6
FONT_SO: length 5.4
  Bottom Layer w0.254: v1(103.87,86.87) 102.5,86.87 102.24,87.14 102.24,87.52 101.85,87.9 100.33,87.9 100.2,87.77 U1.5
IO0: length 11.9
  Top Layer w0.254: v1(103.87,81.79) 103.87,72.79 103.62,73.04 BOOTOPTION.2
IO0_USE: length 3.2
  Top Layer w0.254: BOOTOPTION.1 101.36,70.77 104.14,70.77
IO2:
  vias: v1(100.58,80.3)
IO15: length 91.2
  Top Layer w0.254: v1(99.31,80.3) 99.31,82.69 93.73,88.28 91.44,88.28 91.06,88.66 91.06,90.7 v1(90.55,91.2)
  Bottom Layer w0.254: v1(90.55,91.2) 89.44,90.1 84.76,90.1 84.24,90.62 16.71,90.62 16.13,91.2
IO18:
  vias: v1(103.87,88.14)
IO19: length 33.8
  Top Layer w0.254: R40.1 94.96,70.18 R39.2
  Bottom Layer w0.254: R39.2 94.96,85.58 98.79,89.41 v1(103.87,89.41)
IO21:
  vias: v1(103.87,91.95)
IO22: length 95.2
  Bottom Layer w0.254: v1(103.87,95.76) 94.29,86.19 76.76,86.19 75.53,87.42 75.53,88.13 73.76,89.91 22.14,89.91 18.35,86.12 16.13,86.12
IO23: length 92.5
  Bottom Layer w0.254: 16.13,88.66 20.39,88.66 21.99,90.27 84.09,90.27 85.63,88.73 86.11,88.73 86.17,88.66 95.5,88.66 v1(103.87,97.03)
IO32: length 8.2
  Top Layer w0.254: R2.2 80.77,91.97 83.44,89.3 85.76,89.3 v1(85.87,89.41)
IO33: length 13.7
  Top Layer w0.254: v1(85.87,88.14) 81.04,88.14 78.61,90.57 78.1,90.57 77.85,90.82 77.85,94.38 77.98,94.51 R3.2
LED1_C1: length 29.5
  Top Layer w0.254: LED1.13 37.36,67.42 30.1,74.68 30.1,77.73 30.73,78.37 43.43,78.37 44.07,77.73 U2.19
LED1_C2: length 44.5
  Top Layer w0.254: U2.18 48.64,69.32 48.64,51.06 47.52,49.94 35.28,49.94 34.8,50.43 34.8,52.02 LED1.3
LED1_C3: length 37.6
  Top Layer w0.254: U2.17 46.1,69.32 46.1,60.21 43.56,57.67 43.56,50.81 43.05,50.3 37.72,50.3 37.34,50.68 37.34,52.06 LED1.4
LED1_C4: length 12.8
  Top Layer w0.254: LED1.10 44.86,67.54 36.45,75.95 U2.16
LED1_C5: length 29.4
  Top Layer w0.254: LED1.6 42.29,52.15 42.29,56.9 43.56,58.17 43.56,67.57 42.55,68.59 41.75,68.59 U2.15
LED1_C6: length 15.1
  Top Layer w0.254: U2.14 37.56,70.24 39.6,70.24 42.36,67.48 LED1.11
LED1_C7: length 10.8
  Top Layer w0.254: U2.13 28.83,70.61 LED1.15
LED1_C8: length 10.8
  Top Layer w0.254: U2.12 26.29,70.65 LED1.16
LED1_R1: length 2.8
  Bottom Layer w0.254: LED1.9 47.37,67.09 R31.2
LED1_R1_R: length 26.2
  Bottom Layer w0.254: R31.1 47.35,71.89 44.83,71.89 43.94,71 U6.19
LED1_R2: length 2.6
  Bottom Layer w0.254: R32.2 34.8,67.02 LED1.14
LED1_R2_R: length 15.8
  Bottom Layer w0.254: R32.1 29.95,62.51 23.99,68.46 U6.18
LED1_R3: length 2.8
  Bottom Layer w0.254: R33.2 47.37,52.09 LED1.8
LED1_R3_R: length 34.3
  Bottom Layer w0.254: R33.1 47.37,61.6 45.47,63.51 38.48,63.51 36.17,61.2 30.75,61.2 26.03,65.92 U6.17
LED1_R4: length 2.6
  Bottom Layer w0.254: LED1.12 39.88,67.06 R34.2
LED1_R4_R: length 20.1
  Bottom Layer w0.254: R34.1 37.98,62.51 36.32,60.84 30.61,60.84 28.07,63.38 U6.16
LED1_R5: length 2.9
  Bottom Layer w0.254: LED1.1 29.97,52.19 29.97,54.89
LED1_R5_R: length 11.8
  Bottom Layer w0.254: 29.97,56.89 29.97,59.7 28.83,60.84 U6.15
LED1_R6: length 2.8
  Bottom Layer w0.254: LED1.7 44.83,52.11 R36.2
LED1_R6_R: length 42.6
  Bottom Layer w0.254: R36.1 44.83,59.06 43.81,60.08 38.1,60.08 36.13,58.11 36.13,51.12 35.53,50.53 28.35,50.53 24.38,54.49 20.2,54.49 19.56,55.13 19.56,57.81 20.05,58.3 U6.14
LED1_R7: length 2.8
  Bottom Layer w0.254: LED1.2 32.26,52.18 32.26,54.89
LED1_R7_R: length 11.9
  Bottom Layer w0.254: 32.26,56.89 32.44,56.71 32.44,56.19 32.26,56.01 27.05,56.01 26.8,55.76 U6.13
LED1_R8: length 2.8
  Bottom Layer w0.254: R38.2 39.88,52.1 LED1.5
LED1_R8_R: length 29.6
  Bottom Layer w0.254: R38.1 39.93,56.94 39.93,58.68 39.68,58.93 38.86,58.93 38.61,58.68 38.61,51.31 37.47,50.17 28.2,50.17 25.15,53.22 U6.12
LED2_C1: length 26.3
  Top Layer w0.254: LED2.13 58.18,77.73 58.56,78.11 71.88,78.11 72.14,77.86 U8.19
LED2_C2: length 39.4
  Top Layer w0.254: U8.18 69.6,66.17 66.93,63.51 66.93,50.43 66.45,49.94 57.82,49.94 LED2.3
LED2_C3: length 34.6
  Top Layer w0.254: LED2.4 58.18,50.79 58.67,50.3 63.75,50.3 64.39,50.93 64.39,61.47 67.06,64.14 U8.17
LED2_C4: length 9.8
  Top Layer w0.254: LED2.10 65.68,69.84 64.52,71 U8.16
LED2_C5: length 25.8
  Top Layer w0.254: U8.15 61.98,70.11 64.39,67.7 64.39,61.97 63.18,60.76 LED2.6
LED2_C6: length 10.9
  Top Layer w0.254: U8.14 59.44,70.82 LED2.11
LED2_C7: length 10.9
  Top Layer w0.254: U8.13 56.9,70.8 LED2.15
LED2_C8: length 10.9
  Top Layer w0.254: U8.12 54.36,70.76 LED2.16
LED2_R1: length 2.7
  Bottom Layer w0.254: R30.2 68.2,67.06 LED2.9
LED2_R1_R: length 64.3
  Bottom Layer w0.254: U4.19 79.22,53.22 79.48,53.47 79.48,71.53 78.74,72.27 69.22,72.27 64.39,67.44 64.39,63.63 59.18,58.43 59.18,56.27 59.56,55.89 61.85,55.89 62.1,56.14 62.1,57.4 64.86,60.16 67.13,60.16 68.2,61.22 R30.1
LED2_R2: length 2.7
  Bottom Layer w0.254: LED2.14 55.63,67.03 R29.2
LED2_R2_R: length 67.1
  Bottom Layer w0.254: U4.18 78.74,55.76 79.12,56.14 79.12,59.06 78.49,59.7 76.2,59.7 75.56,60.33 75.56,61.47 76.2,62.11 78.23,62.11 78.74,62.62 78.74,64.27 78.23,64.78 74.41,64.78 66.93,57.3 66.93,50.35 66.68,50.09 52.53,50.09 51.94,50.68 51.94,58.81 52.58,59.44 54.36,59.44 55.63,60.71 R29.1
LED2_R3: length 2.8
  Bottom Layer w0.254: 68.2,54.89 68.2,52.1 LED2.8
LED2_R3_R: length 8.5
  Bottom Layer w0.254: U4.17 75.44,58.3 71.63,54.49 R28.1
LED2_R4: length 2.7
  Bottom Layer w0.254: R27.2 60.71,67.05 LED2.12
LED2_R4_R: length 54.6
  Bottom Layer w0.254: R27.1 60.58,62.25 60.58,61.09 57.78,58.3 57.78,54.87 59.44,53.22 59.44,51.44 60.07,50.81 61.34,50.81 62.03,51.49 62.03,53.4 62.61,53.98 62.61,57.41 65,59.8 67.92,59.8 69.85,61.73 69.85,63.13 76.45,69.73 78.36,69.73 79.1,68.99 79.1,61.2 78.74,60.84 U4.16
LED2_R5: length 2.8
  Bottom Layer w0.254: LED2.1 50.67,52.09 R26.2
LED2_R5_R: length 50.6
  Bottom Layer w0.254: R26.1 50.67,58.93 50.29,59.32 49.78,59.32 49.4,58.93 49.4,51.06 50.72,49.74 68.4,49.74 69.34,50.68 69.34,59.21 73.52,63.38 U4.15
LED2_R6: length 2.8
  Bottom Layer w0.254: LED2.7 65.66,52.1 R25.2
LED2_R6_R: length 16.1
  Bottom Layer w0.254: R25.1 65.66,58.17 66.57,59.09 68.22,59.09 75.05,65.92 U4.14
LED2_R7: length 2.8
  Bottom Layer w0.254: R24.2 53.21,52.12 LED2.2
LED2_R7_R: length 44.2
  Bottom Layer w0.254: U4.13 77.08,68.46 68.07,59.44 65.15,59.44 63.5,57.79 63.5,54.24 64.39,53.35 64.39,51.19 63.65,50.45 57.63,50.45 56.9,51.19 56.9,56.01 54.48,58.43 53.47,58.43 53.21,58.17 R24.1
LED2_R8: length 2.8
  Bottom Layer w0.254: R23.2 60.71,52.11 LED2.5
LED2_R8_R: length 25.3
  Bottom Layer w0.254: R23.1 60.71,58.43 66.8,64.52 66.8,67.82 69.98,71 U4.12
LED3_C1: length 18.8
  Top Layer w0.254: LED3.13 37.34,46.35 37.34,43.82 36.33,42.81 U3.19
LED3_C2: length 29.9
  Top Layer w0.254: LED3.3 34.8,31.31 34.8,29.85 33.78,28.84 20.19,28.84 19.13,29.9 19.13,38.69 20.7,40.27 U3.18
LED3_C3: length 62.1
  Top Layer w0.254: U3.17 35.31,37.73 41.15,43.56 41.15,47.38 42.67,48.9 47.5,48.9 48.64,47.76 48.64,42.42 43.56,37.34 43.56,30.61 42.42,29.47 37.72,29.47 37.34,29.85 37.34,31.35 LED3.4
LED3_C4: length 40.8
  Top Layer w0.254: LED3.10 44.98,46.24 44.98,45.88 33.65,34.55 33.65,29.97 32.87,29.19 25.42,29.19 23.24,31.38 20.57,31.38 19.84,32.11 19.84,34.45 20.57,35.19 U3.16
LED3_C5: length 50.1
  Top Layer w0.254: U3.15 31.24,32.65 43.56,44.96 43.56,47.25 44.2,47.89 45.59,47.89 46.1,47.38 46.1,40.39 42.29,36.58 42.29,31.44 LED3.6
LED3_C6: length 35.1
  Top Layer w0.254: LED3.11 42.36,44.27 34.56,36.46 20.58,36.46 19.48,35.36 19.48,31.58 20.83,30.23 21.37,30.23 U3.14
LED3_C7: length 46.5
  Top Layer w0.254: U3.13 20.7,27.57 18.77,29.5 18.77,39.99 20.32,41.54 35.56,41.54 38.61,44.58 38.61,47.63 38.35,47.89 32.61,47.89 32.36,47.63 LED3.15
LED3_C8: length 31.6
  Top Layer w0.254: LED3.16 27.56,44.08 20.32,44.08 18.42,42.17 18.42,28.58 21.5,25.5 U3.12
LED3_R1: length 2.8
  Bottom Layer w0.254: 47.37,46.38 LED3.9 47.37,46.36 R7.2
LED3_R1_R: length 59.7
  Bottom Layer w0.254: R7.1 47.37,40.14 47.12,39.88 46.48,39.88 46.1,40.27 46.1,48.39 45.21,49.28 28.58,49.28 27.71,48.42 27.71,20.89 U7.19
LED3_R2: length 2.8
  Bottom Layer w0.254: LED3.14 34.86,43.61 R8.2
LED3_R2_R: length 61
  Bottom Layer w0.254: U7.18 28.83,23.25 28.07,24.01 28.07,48.27 28.72,48.93 39.85,48.93 41.21,47.57 41.21,39.19 40.39,38.36 35.56,38.36 34.8,39.12 R8.1
LED3_R3: length 4.6
  Bottom Layer w0.254: R9.2 47.37,31.36 LED3.8
LED3_R3_R: length 23.7
  Bottom Layer w0.254: R9.1 47.37,22.61 45.34,20.58 45.34,17.81 45.09,17.56 31.62,17.56 31.37,17.81 U7.17
LED3_R4: length 2.9
  Bottom Layer w0.254: R10.2 39.88,46.35 LED3.12 39.88,46.39
LED3_R4_R: length 59.4
  Bottom Layer w0.254: U7.16 33.91,18.22 34.16,17.96 37.53,17.96 37.78,18.22 37.78,21.53 36.96,22.36 31.49,22.36 31.12,22.74 31.12,47.27 32.42,48.57 37.29,48.57 38.61,47.25 38.61,40.01 38.99,39.63 39.62,39.63 39.93,39.94 39.93,41.5 R10.1
LED3_R5: length 4.6
  Bottom Layer w0.254: R11.2 29.84,31.36 LED3.1
LED3_R5_R: length 9.6
  Bottom Layer w0.254: U7.15 35.91,19.47 33.38,22 31.34,22 29.84,23.5 R11.1
LED3_R6: length 4.6
  Bottom Layer w0.254: LED3.7 44.83,31.34 R12.2
LED3_R6_R: length 22.9
  Bottom Layer w0.254: U7.14 38.99,18.17 39.24,17.91 42.55,17.91 42.8,18.17 42.8,20.84 40.52,23.12 38.99,23.12 38.23,23.88 38.23,25.28 38.8,25.85 44.51,25.85 44.83,25.53 R12.1
LED3_R7: length 4.6
  Bottom Layer w0.254: R13.2 32.39,31.34 LED3.2
LED3_R7_R: length 12
  Bottom Layer w0.254: U7.13 38.28,22.72 33.3,22.72 32.39,23.63 R13.1
LED3_R8: length 4.6
  Bottom Layer w0.254: R14.2 39.88,31.35 LED3.5
LED3_R8_R: length 7.1
  Bottom Layer w0.254: R14.1 39.88,24.26 44.07,20.07 U7.12
LED4_C1: length 47
  Top Layer w0.254: LED4.13 61.98,42.46 61.98,30.23 62.48,29.72 63.88,29.72 64.39,30.23 64.39,31.88 68.35,35.85 72.62,35.85 76.07,32.39 78.49,32.39 78.74,32.14 78.74,26.3 78.49,26.04 U9.19
LED4_C2: length 23.8
  Top Layer w0.254: LED4.3 55.68,29.67 56.9,28.45 77.18,28.45 U9.18
LED4_C3: length 21.6
  Top Layer w0.254: LED4.4 58.17,31.25 58.17,29.98 59.06,29.09 69.72,29.09 71.75,31.12 U9.17
LED4_C4: length 22
  Top Layer w0.254: LED4.10 74.47,37.47 78.49,37.47 78.87,37.09 78.87,33.79 78.56,33.48 77.49,33.48 U9.16
LED4_C5: length 16.2
  Top Layer w0.254: LED4.6 63.26,31.26 68.2,36.2 U9.15
LED4_C6: length 20.4
  Top Layer w0.254: LED4.11 64.42,47.5 68.71,47.5 69.85,46.36 69.85,42.81 73.91,38.74 U9.14
LED4_C7: length 27.5
  Top Layer w0.254: U9.13 75.95,41.28 69.37,47.86 54.78,47.86 LED4.15
LED4_C8: length 29.3
  Top Layer w0.254: LED4.16 52.63,48.22 71.55,48.22 75.95,43.82 U9.12
LED4_R1: length 2.8
  Bottom Layer w0.254: R15.2 68.2,46.24 LED4.9
LED4_R1_R: length 41.7
  Bottom Layer w0.254: R15.1 68.2,42.17 67.94,42.42 59.56,42.42 56.9,39.76 56.9,28.33 58.29,26.93 58.29,17.79 57.91,17.41 54.74,17.41 54.48,17.66 U5.19
LED4_R2: length 2.9
  Bottom Layer w0.254: LED4.14 55.68,43.48 R16.2
LED4_R2_R: length 23.5
  Bottom Layer w0.254: R16.1 55.63,34.3 54.48,33.15 54.48,28.33 57.02,25.79 U5.18
LED4_R3: length 2.8
  Bottom Layer w0.254: R17.2 68.18,34.04 LED4.8
LED4_R3_R: length 23.3
  Bottom Layer w0.254: R17.1 63.1,36.06 59.44,32.39 59.44,19.6 59.56,19.47
LED4_R4: length 2.8
  Bottom Layer w0.254: LED4.12 60.71,46.23 R18.2
LED4_R4_R: length 37.3
  Bottom Layer w0.254: 62.1,19.47 61.98,19.6 61.98,34.43 62.61,35.06 69.09,35.06 69.85,35.82 69.85,37.22 69.09,37.98 61.47,37.98 60.71,38.74 R18.1
LED4_R5: length 4.6
  Bottom Layer w0.254: LED4.1 50.67,31.26 R19.2
LED4_R5_R: length 45.2
  Bottom Layer w0.254: R19.1 50.67,23.12 53.34,20.45 53.34,17.41 53.7,17.05 72.92,17.05 73.53,17.66 73.53,20.45 72.9,21.09 71.63,21.09 70.99,20.45 70.99,18.04 70.74,17.79 64.9,17.79 64.64,18.04 U5.15
LED4_R6: length 4.6
  Bottom Layer w0.254: R20.2 65.66,31.24 LED4.7
LED4_R6_R: length 5.8
  Bottom Layer w0.254: R20.1 65.66,21.85 67.18,20.33 U5.14
LED4_R7: length 2.3
  Bottom Layer w0.254: LED4.2 53.21,31.3 R21.2
LED4_R7_R: length 56.1
  Bottom Layer w0.254: 69.72,19.47 69.72,34.17 70.21,34.65 70.21,46.89 69.34,47.76 54.99,47.76 54.48,47.25 54.48,41.41 53.21,40.14 R21.1
LED4_R8: length 4.6
  Bottom Layer w0.254: R22.2 60.71,31.23 LED4.5
LED4_R8_R: length 20.4
  Bottom Layer w0.254: R22.1 60.83,24.53 60.83,17.69 61.09,17.43 71.91,17.43 72.26,17.79 72.26,19.47
RXD0: length 103.9
  Top Layer w0.254: v1(103.87,93.22) 105.2,93.22 105.31,93.11 105.31,65.45 104.65,64.79 UART.3
  Bottom Layer w0.254: UART.3 99.69,64.79 99.01,64.1 99.01,57.73 99.19,57.55 108.71,57.55 108.96,57.29 108.96,20.46 108.59,20.08 101.22,20.08 100.2,19.07 100.2,15.51 100.46,15.26 v1(101.74,15.26)
TP4056_CE: length 6.3
  Top Layer w0.254: U14.8 103.11,35.61 v1(103.17,35.67)
  Bottom Layer w0.254: v1(103.17,35.67) 103.88,35.67 SW1.2
TXD0: length 98.4
  Top Layer w0.254: UART.2 104.9,62.25 105.66,63.01 105.66,94.25 105.42,94.49 v1(103.87,94.49)
  Bottom Layer w0.254: UART.2 109.09,62.25 109.47,61.87 109.47,20.35 108.45,19.32 104.78,19.32 104.52,19.07 104.52,17.42 103.63,16.53 v1(101.74,16.53)
UD+: length 18.3
  Top Layer w0.254: 98.68,6.11 98.43,6.37 98.43,8.02 USB1.A6 ; 98.68,6.11 USB2.3 ; 98.68,6.11 99.19,6.11 99.43,6.36 USB1.B6 99.43,16.41 98.04,17.8 v1(96.38,17.8)
UD-: length 18.3
  Top Layer w0.254: USB1.A7 98.93,8.03 98.93,9.03 ; 98.04,5.22 98.04,5.73 97.66,6.11 97.66,6.62 97.93,6.89 USB1.B7 97.93,9.05 98.04,9.16 98.81,9.16 98.93,9.03 ; 98.93,9.03 98.93,10.81 98.55,11.19 97.92,11.19 97.6,11.51 97.6,12.46 97.89,12.75 98.68,12.75 98.98,13.05 98.98,13.73 98.68,14.04 98.68,15.13 98.93,15.38 98.93,16.27 98.68,16.53 v1(96.38,16.53)
$1N5018: length 7.6
  Top Layer w0.254: C14.2 76.87,99.74 R4.1 72.61,99.74 RST.2
$1N5403: length 10.4
  Top Layer w0.254: C12.2 69.68,92.03 X1.2 73.16,91.99 R1.2 76.58,92.24 R2.1
$1N5415: length 10.3
  Top Layer w0.254: C13.2 69.7,94.51 X1.1 73.16,94.49 R1.1 76.58,94.24 R3.1
$1N8034: length 4.3
  Top Layer w0.254: C17.1 106.03,17.8 v1(101.74,17.8)
$1N9172: length 7.2
  Top Layer w0.254: R6.2 103.57,38.02 104.69,36.89 104.69,34.73 104.3,34.34 v1(103.1,34.34)
$1N9198: length 2.8
  Top Layer w0.254: LED5.1 101.56,39.74 R6.1
$1N9310: length 3.8
  Top Layer w0.254: v1(97.28,34.34) 97.28,34.35 95.55,34.35 95.18,33.99 Rprog.2

## Text on the board
Top Silkscreen Layer: 电子挂牌V0.0
